# Altium schematic sheet AES17Filter.SchDoc: Overview
size 287 x 198 mm; DocumentNumber: 1; Revision: 1.0; SheetNumber: 1; SheetTotal: 2
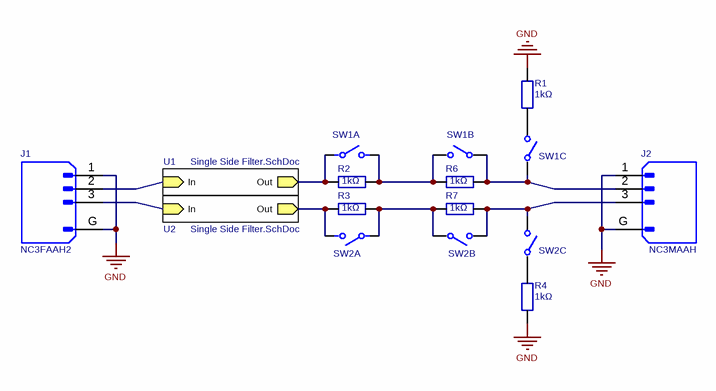
[diagram p0: AES17Filter.SchDoc]

## Parts
J1  MPN: NC3FAAH2  [NEUTRIK_NC3FAAH2]
J2  (no value)  [NEUTRIK_NC3MAAH]
R1  value 1kΩ  [RESC6432X06N]
R2  value 1kΩ  [RESC6432X06N]
R3  value 1kΩ  [RESC6432X06N]
R4  value 1kΩ  [RESC6432X06N]
R6  value 1kΩ  [RESC6432X06N]
R7  value 1kΩ  [RESC6432X06N]
SW1  (no value)  [FP-A6S-3101-H-MFG]  (parts A,B,C of 3)
SW2  (no value)  [FP-A6S-3101-H-MFG]  (parts A,B,C of 3)

## Sub-sheets
U1 = Single Side Filter.SchDoc: Out (out), In (in)
U2 = Single Side Filter.SchDoc: Out (out), In (in)

## Nets
GND: J1.1 J1.G J2.1 J2.G R1.2 R4.2
NetJ1_2: J1.2 ; sheet U1/In
NetJ1_3: J1.3 ; sheet U2/In
NetJ2_2: J2.2 R6.2 SW1.2 SW1.3
NetJ2_3: J2.3 R7.2 SW2.4 SW2.5
NetR1_1: R1.1 SW1.4
NetR2_1: R2.1 SW1.1 ; sheet U1/Out
NetR2_2: R2.2 R6.1 SW1.5 SW1.6
NetR3_1: R3.1 R7.1 SW2.1 SW2.2
NetR3_2: R3.2 SW2.6 ; sheet U2/Out
NetR4_1: R4.1 SW2.3

## Notes on the sheet
- Redako
- Keilestraat 5a, 3029BP, Rotterdam, M: david@redako.nl, T: +31 6 16001008
- Project
- Title
- Customer
- Size:
- Date:
- File:
- A4
- Revision:
- Time:
- Drawn by:
- GIT Revision:
- Sheet:
- of

## Library data of the parts
J1 J2 = NC3MAAH: 3 pole male XLR receptacle, grounding: separate ground contact to mating connector shell and front panel, horizontal PCB mount; Value: *
  J2: MPN: NC3MAAH
R1-R4 R6 R7 = Res: Tolerance: 1%; Rating: 200V; Package: 2512
SW1 SW2 = CMP-08827-000069-1: SWITCH SLIDE DIP SPST 25MA 24V; MPN: A6S-3101-H